# EasyEDA Pro project ProProject_Access Control Core_2024-06-07.epro, board V2.0.1 Core PCB
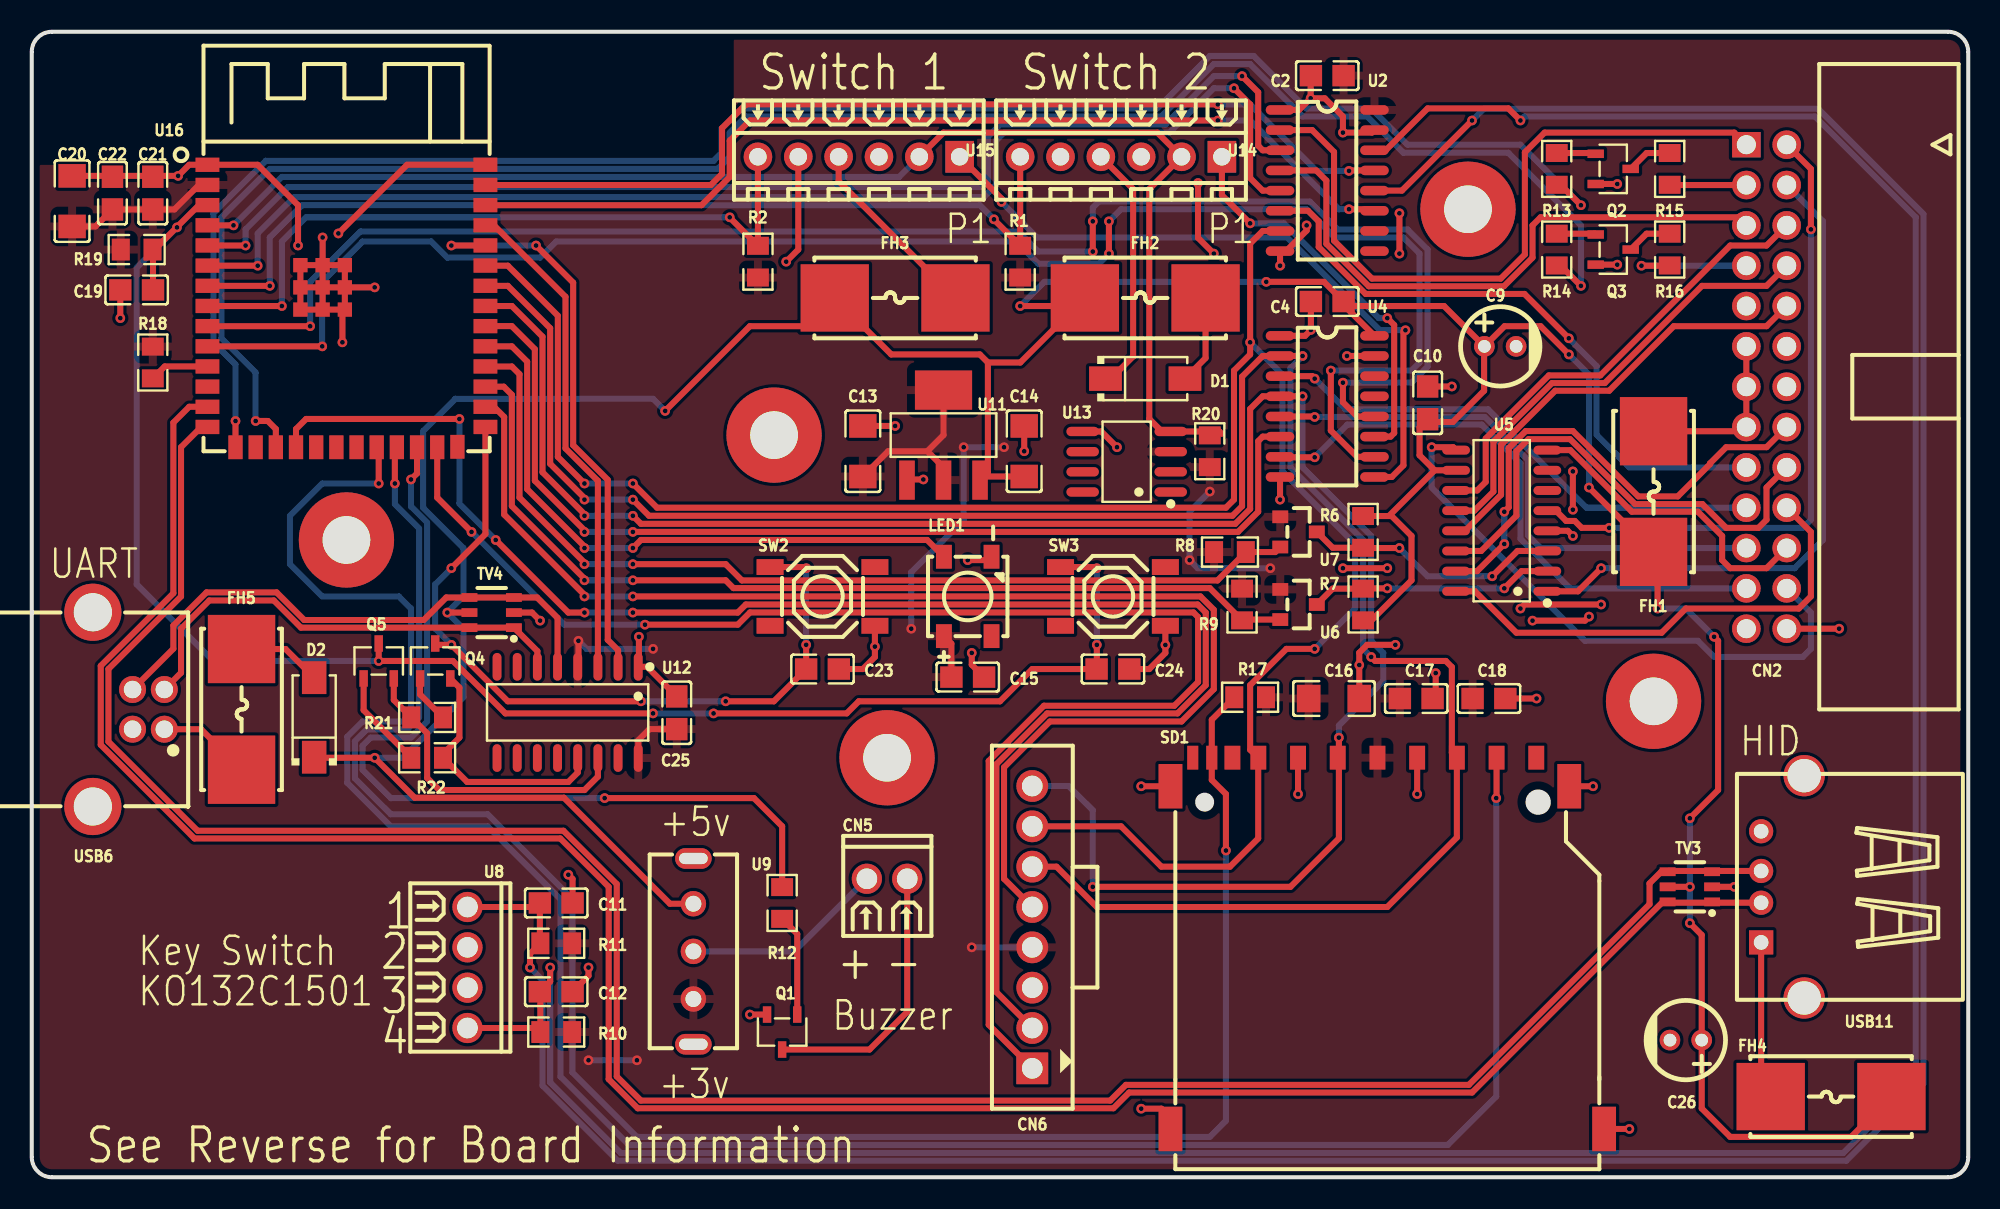
[diagram p13: board, top side]
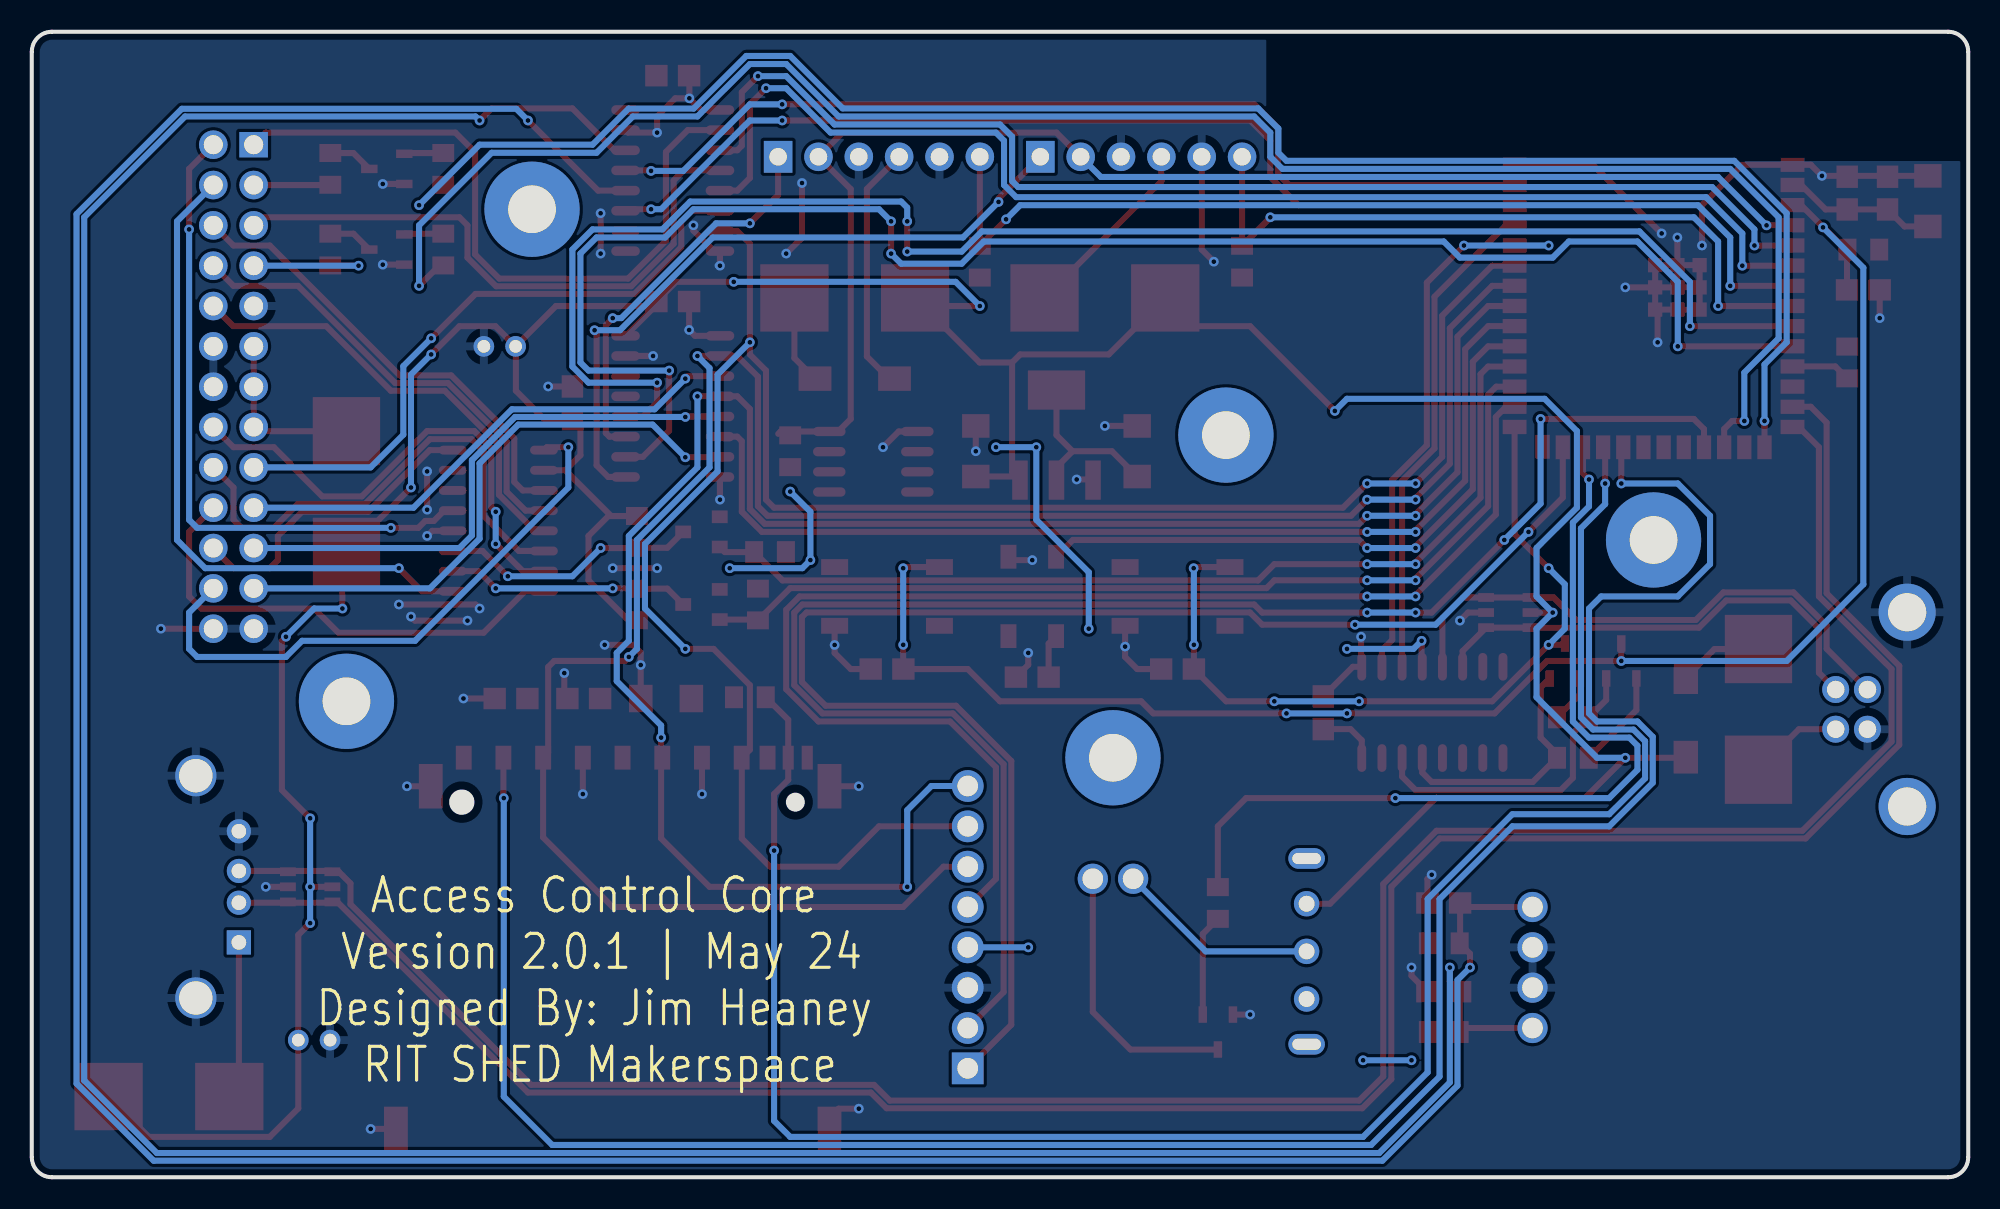
[diagram p14: board, bottom side, seen from below]

Outline 121.92 x 72.14 mm; copper layers: Top Layer, Bottom Layer. Coordinates in mm from the lower left corner of the outline.
Outline path: 0,70.87 0,1.27 arc(0.37,0.37) 1.27,0 120.65,0 arc(121.55,0.37) 121.92,1.27 121.92,70.87 arc(121.55,71.76) 120.65,72.14 1.27,72.14 arc(0.37,71.76) 0,70.87
Stack: Top Layer 0.035mm / Dielectric1 1.51mm FR4 er 4.5 / Bottom Layer 0.035mm

## Design rules (mm)
template: JLCPCB Capability(Two Layers Board)
spacing copperThickness1oz (default): track to track 0.102, other pairs 0.152 to 0.3
spacing copperThickness2oz: track to track 0.203, other pairs 0.152 to 0.3
track width copperThickness1oz (default): min 0.127, default 0.254, max 2.54
track width copperThickness2oz: min 0.203, default 0.254, max 2.54
differential pair differentialPair (default): width min 0.127, default 0.254, max 2.54; gap min 0.152, default 0.152
via viaSize (default): diameter min 0.5, default 0.61, max 10; hole min 0.3, default 0.305, max 6.3

## Placement (name value [footprint] x y rotation side)
C2  100nF  [C0805]  81.56 69.37 0 top
C4  100nF  [C0805]  81.56 55.15 0 top
C9  100uF  [CAP-TH_BD5.0-P2.00-D0.8-FD]  92.46 52.32 0 top
C10  100nF  [C0805]  87.88 48.77 270 top
C11  100nF  [C0805]  33.02 17.27 180 top
C12  100nF  [C0805]  33.02 11.68 0 top
C13  22uF  [C1206]  52.32 45.72 270 top
C14  22uF  [C1206]  62.48 45.72 270 top
C15  100nF  [C0805]  58.93 31.5 180 top
C16  22uF  [C1206]  81.99 30.15 180 top
C17  100nF  [C0805]  87.17 30.15 180 top
C18  100nF  [C0805]  91.75 30.15 180 top
C19  1uF  [C0805]  6.6 55.88 0 top
C20  22uF  [C1206]  2.54 61.47 270 top
C21  100nF  [C0805]  7.62 61.98 270 top
C22  1uF  [C0805]  5.08 61.98 270 top
C23  100nF  [C0805]  49.78 32 0 top
C24  100nF  [C0805]  68.07 32 0 top
C25  100nF  [C0805]  40.61 29.25 90 top
C26  100uF  [CAP-TH_BD5.0-P2.00-D0.8-FD]  104.14 8.64 180 top
CN2  2.54-2*13P弯简牛  [IDC-TH_26P-P2.54_BOOMELE-2X13P-2.54MM-H]  109.22 49.78 90 top
CN5  MX128-2.54-02P-GN01-Cu-Y-A  [CONN-TH_2P-P2.54_MX128-2.54-GN01-02P-CU-Y-A]  53.85 18.8 0 top
CN6  X9556WV-08-N0V01  [CONN-TH_8P-P2.54_X9556WV-08-N0V01]  62.99 15.75 90 top
D1  SS54  [SMA_L4.4-W2.8-LS5.4-R-RD]  70.1 50.29 0 top
D2  SS54  [SMA_L4.4-W2.8-LS5.4-R-RD]  17.78 28.96 90 top
FH1  01550900M  [FUSE-SMD_L9.8-W5.0]  102.11 43.18 90 top
FH2  01550900M  [FUSE-SMD_L9.8-W5.0]  70.1 55.37 180 top
FH3  01550900M  [FUSE-SMD_L9.8-W5.0]  54.36 55.37 180 top
FH4  01550900M  [FUSE-SMD_L9.8-W5.0]  113.28 5.08 0 top
FH5  01550900M  [FUSE-SMD_L9.8-W5.0]  13.21 29.46 90 top
LED1  XL-5050RGBC-WS2812B  [LED-SMD_4P-L5.0-W5.0-BL_XL-5050RGBC]  58.93 36.58 0 top
NOREF  -  [Pad_e102]  19.81 40.13 0 top
NOREF#2  -  [Pad_e104]  102.11 29.97 0 top
NOREF#3  -  [Pad_e100]  53.85 26.42 0 top
NOREF#4  -  [Pad_e103]  46.74 46.74 0 top
NOREF#5  -  [Pad_e112]  90.42 60.96 0 top
Q1  S8050 J3Y  [SOT-23-3_L3.0-W1.7-P0.95-LS2.9-BR]  47.24 9.14 90 top
Q2  S8050 J3Y  [SOT-23-3_L3.0-W1.7-P0.95-LS2.9-BR]  99.57 63.5 180 top
Q3  S8050 J3Y  [SOT-23-3_L3.0-W1.7-P0.95-LS2.9-BR]  99.57 58.42 180 top
Q4  S8050 J3Y  [SOT-23-3_L3.0-W1.7-P0.95-LS2.9-BR]  25.4 32.51 270 top
Q5  S8050 J3Y  [SOT-23-3_L3.0-W1.7-P0.95-LS2.9-BR]  21.84 32.51 270 top
R1  5.1kΩ  [R0805]  62.23 57.66 90 top
R2  5.1kΩ  [R0805]  45.72 57.66 90 top
R6  10kΩ  [R0805]  83.82 40.64 90 top
R7  10kΩ  [R0805]  83.82 36.07 270 top
R8  10kΩ  [R0805]  75.44 39.37 180 top
R9  10kΩ  [R0805]  76.2 36.07 90 top
R10  100kΩ  [R0805]  33.02 9.14 0 top
R11  100kΩ  [R0805]  33.02 14.73 180 top
R12  10kΩ  [R0805]  47.24 17.27 90 top
R13  10kΩ  [R0805]  96.01 63.5 270 top
R14  10kΩ  [R0805]  96.01 58.42 270 top
R15  1kΩ  [R0805]  103.12 63.5 270 top
R16  1kΩ  [R0805]  103.12 58.42 270 top
R17  10kΩ  [R0805]  76.71 30.23 180 top
R18  10kΩ  [R0805]  7.62 51.31 270 top
R19  10kΩ  [R0805]  6.6 58.42 0 top
R20  4.7kΩ  [R0805]  74.17 45.72 270 top
R21  10kΩ  [R0805]  24.89 28.96 180 top
R22  10kΩ  [R0805]  24.89 26.42 0 top
SD1  SD-112  [SD-SMD_SD-112]  85.34 14.73 0 top
SW2  TS-1187A-B-A-B  [SW-SMD_4P-L5.1-W5.1-P3.70-LS6.5-TL-2]  49.78 36.58 0 top
SW3  TS-1187A-B-A-B  [SW-SMD_4P-L5.1-W5.1-P3.70-LS6.5-TL-2]  68.07 36.58 0 top
TV3  SRV05-4-P-T7  [SOT-23-6_L2.9-W1.6-P0.95-LS2.8-BR]  104.39 18.29 0 top
TV4  SRV05-4-P-T7  [SOT-23-6_L2.9-W1.6-P0.95-LS2.8-BR]  28.96 35.56 0 top
U2  SN74HCS367DR  [SOIC-16_L9.9-W3.9-P1.27-LS6.0-BL-1]  81.56 62.77 270 top
U4  SN74HCS367DR  [SOIC-16_L9.9-W3.9-P1.27-LS6.0-BL-1]  81.56 48.54 270 top
U5  TM1650-SOP16-TA1809C  [SOP-16_L10.0-W3.9-P1.27-LS6.0-BL]  92.55 41.34 90 top
U6  BSS138LT1G-ES  [SOT-23_L2.9-W1.3-P1.90-LS2.4-BR]  79.76 36.07 180 top
U7  BSS138LT1G-ES  [SOT-23_L2.9-W1.3-P1.90-LS2.4-BR]  79.76 40.64 180 top
U8  MX128-2.54-04P-GN01-Cu-Y-A  [CONN-TH_4P-P2.54_MX128-2.54-GN01-04P-CU-Y-A]  27.43 13.21 270 top
U9  HX SS12F44G4  [SW-TH_SHOU-HAN_SS12F44G4]  41.66 14.22 90 top
U11  AMS1117-3.3  [SOT-223-4_L6.5-W3.5-P2.30-LS7.0-BR]  57.4 46.74 270 top
U12  CH340C  [SOP-16_L10.0-W3.9-P1.27-LS6.0-BL]  33.74 29.27 180 top
U13  DS18B20Z+T&R  [SOIC-8_L4.9-W3.9-P1.27-LS6.0-BL]  68.94 45.06 90 top
U14  MX128-2.54-06P-GN01-Cu-Y-A  [CONN-TH_6P-P2.54_MX128-2.54-6P]  68.58 64.26 180 top
U15  MX128-2.54-06P-GN01-Cu-Y-A  [CONN-TH_6P-P2.54_MX128-2.54-6P]  52.07 64.26 180 top
U16  2.4GHz  [WIRELM-SMD_ESP32-S3-WROOM-1]  19.81 54.86 0 top
USB6  BF 90°  [USB-B_TH_BF90]  6.1 29.46 270 top
USB11  903-131A1011D10100  [USB-A-TH_C46407]  110.24 18.29 90 top

## Footprints (pads in the part's own frame, mm; a bottom-side part is the same pattern mirrored in y, then rotated)
C0805
  rect 1.41x1.35 smd: 1(-1.03,0) 2(1.03,0)
C1206
  rect 1.485x1.728 smd: 1(-1.593,0) 2(1.593,0)
CAP-TH_BD5.0-P2.00-D0.8-FD
  round 1.3 hole 0.8: 1(-1,0) 2(1,0)
CONN-TH_2P-P2.54_MX128-2.54-GN01-02P-CU-Y-A
  round 1.9 hole 1.3: 1(-1.27,0) 2(1.27,0)
CONN-TH_4P-P2.54_MX128-2.54-GN01-04P-CU-Y-A
  round 1.9 hole 1.3: 1(-3.81,0) 2(-1.27,0) 3(1.27,0) 4(3.81,0)
CONN-TH_6P-P2.54_MX128-2.54-6P
  rect 1.8x2 hole 1.1: 1(-6.35,0)
  round 1.8 hole 1.1: 2(-3.81,0) 3(-1.27,0) 4(1.27,0) 5(3.81,0) 6(6.35,0)
CONN-TH_8P-P2.54_X9556WV-08-N0V01
  rect 2x2 hole 1.3: 1(-8.89,0)
  round 2 hole 1.3: 2(-6.35,0) 3(-3.81,0) 4(-1.27,0) 5(1.27,0) 6(3.81,0) 7(6.35,0) 8(8.89,0)
FUSE-SMD_L9.8-W5.0
  rect 4.3x4.24 smd: 1(-3.8,0) 2(3.8,0)
IDC-TH_26P-P2.54_BOOMELE-2X13P-2.54MM-H
  rect 1.6x1.8 hole 1.2: 1(15.24,1.27)
  round 1.8 hole 1.2: 2(15.24,-1.27) 3(12.7,1.27) 4(12.7,-1.27) 5(10.16,1.27) 6(10.16,-1.27) 7(7.62,1.27) 8(7.62,-1.27) 9(5.08,1.27) 10(5.08,-1.27) 11(2.54,1.27) 12(2.54,-1.27) 13(0,1.27) 14(0,-1.27) 15(-2.54,1.27) 16(-2.54,-1.27) 17(-5.08,1.27) 18(-5.08,-1.27) 19(-7.62,1.27) 20(-7.62,-1.27) 21(-10.16,1.27) 22(-10.16,-1.27) 23(-12.7,1.27) 24(-12.7,-1.27) 25(-15.24,1.27) 26(-15.24,-1.27)
LED-SMD_4P-L5.0-W5.0-BL_XL-5050RGBC
  rect 1x1.5 smd: 1(-1.5,-2.5) 2(1.5,-2.5) 3(1.5,2.5) 4(-1.5,2.5)
Pad_e100
  round 6 hole 3: 42(0,0)
Pad_e102
  round 6 hole 3: 42(0,0)
Pad_e103
  round 6 hole 3: 42(0,0)
Pad_e104
  round 6 hole 3: 42(0,0)
Pad_e112
  round 6 hole 3: 42(0,0)
R0805
  rect 1.133x1.377 smd: 1(-1,0) 2(1,0)
SD-SMD_SD-112
  rect 1x1.5 smd: 1(6.88,11.69) 2(4.38,11.69) 3(1.88,11.69) 4(-0.62,11.69) 5(-3.12,11.69) 6(-5.62,11.69) 7(-8.12,11.69) 8(-9.75,11.69) 9(9.38,11.69)
  rect 0.7x1.5 smd: 10(-11.05,11.69) 11(-12.25,11.69)
  rect 1.5x2.8 smd: 12(-13.65,9.89) 12(-13.65,-11.69) 12(11.455,9.89) 12(13.65,-11.69)
SMA_L4.4-W2.8-LS5.4-R-RD
  rect 2.062x1.539 smd: 1(2.503,0) 2(-2.503,0)
SOIC-8_L4.9-W3.9-P1.27-LS6.0-BL
  oval 0.588x2.045 smd: 1(-1.905,-2.772) 2(-0.635,-2.772) 3(0.635,-2.772) 4(1.905,-2.772) 5(1.905,2.772) 6(0.635,2.772) 7(-0.635,2.772) 8(-1.905,2.772)
SOIC-16_L9.9-W3.9-P1.27-LS6.0-BL-1
  oval 0.6x1.8 smd: 1(-4.445,-2.972) 2(-3.175,-2.972) 3(-1.905,-2.972) 4(-0.635,-2.972) 5(0.635,-2.972) 6(1.905,-2.972) 7(3.175,-2.972) 8(4.445,-2.972) 9(4.445,2.972) 10(3.175,2.972) 11(1.905,2.972) 12(0.635,2.972) 13(-0.635,2.972) 14(-1.905,2.972) 15(-3.175,2.972) 16(-4.445,2.972)
SOP-16_L10.0-W3.9-P1.27-LS6.0-BL
  oval 0.56x1.745 smd: 1(-4.445,-2.873) 2(-3.175,-2.873) 3(-1.905,-2.873) 4(-0.635,-2.873) 5(0.635,-2.873) 6(1.905,-2.873) 7(3.175,-2.873) 8(4.445,-2.873) 9(4.445,2.873) 10(3.175,2.873) 11(1.905,2.873) 12(0.635,2.873) 13(-0.635,2.873) 14(-1.905,2.873) 15(-3.175,2.873) 16(-4.445,2.873)
SOT-23-3_L3.0-W1.7-P0.95-LS2.9-BR
  rect 1.038x0.532 smd: 1(1.101,-0.95) 2(1.101,0.95) 3(-1.101,0)
SOT-23-6_L2.9-W1.6-P0.95-LS2.8-BR
  rect 1x0.55 smd: 1(1.4,-0.95) 2(1.4,0) 3(1.4,0.95) 4(-1.4,0.95) 5(-1.4,0) 6(-1.4,-0.95)
SOT-23_L2.9-W1.3-P1.90-LS2.4-BR
  rect 1x0.8 smd: 1(1.15,-0.95) 2(1.15,0.95) 3(-1.15,0)
SOT-223-4_L6.5-W3.5-P2.30-LS7.0-BR
  rect 2.47x0.98 smd: 1(2.835,-2.3) 2(2.835,0) 3(2.835,2.3)
  rect 2.47x3.6 smd: 4(-2.835,0)
SW-SMD_4P-L5.1-W5.1-P3.70-LS6.5-TL-2
  rect 1.7x1 smd: 1(-3.3,1.85) 2(3.3,1.85) 3(-3.3,-1.85) 4(3.3,-1.85)
SW-TH_SHOU-HAN_SS12F44G4
  round 1.6 hole 1: 1(-3,0) 2(0,0) 3(3,0)
  oval 1.3x2.3 hole 0.7x1.8: 4(5.85,0) 5(-5.85,0)
USB-A-TH_C46407
  rect 1.524x1.524 hole 0.92: 1(-3.5,1.355)
  round 1.524 hole 0.92: 2(-1,1.355) 3(1,1.355) 4(3.5,1.355)
  round 2.6 hole 2.1: 5(7,-1.355) 6(-7,-1.355)
USB-B_TH_BF90
  round 1.7 hole 1.1: 1(1.25,2.25) 2(-1.25,2.25) 3(-1.25,0.25) 4(1.25,0.25)
  round 3.6 hole 2.4: 5(-6.117,-2.25) 5(6.117,-2.25)
WIRELM-SMD_ESP32-S3-WROOM-1
  rect 1.5x0.9 smd: 1(-8.75,8.895) 2(-8.75,7.625) 3(-8.75,6.355) 4(-8.75,5.085) 5(-8.75,3.815) 6(-8.75,2.545) 7(-8.75,1.275) 8(-8.75,0.005) 9(-8.75,-1.265) 10(-8.75,-2.535) 11(-8.75,-3.805) 12(-8.75,-5.075) 13(-8.75,-6.345) 14(-8.75,-7.615) 27(8.75,-7.615) 28(8.75,-6.345) 29(8.75,-5.075) 30(8.75,-3.805) 31(8.75,-2.535) 32(8.75,-1.265) 33(8.75,0.005) 34(8.75,1.275) 35(8.75,2.545) 36(8.75,3.815) 37(8.75,5.085) 38(8.75,6.355) 39(8.75,7.625) 40(8.75,8.895)
  rect 0.9x1.5 smd: 15(-6.985,-8.895) 16(-5.715,-8.895) 17(-4.445,-8.895) 18(-3.175,-8.895) 19(-1.905,-8.895) 20(-0.635,-8.895) 21(0.635,-8.895) 22(1.905,-8.895) 23(3.175,-8.895) 24(4.445,-8.895) 25(5.715,-8.895) 26(6.985,-8.865)
  rect 0.9x0.9 smd: 41(-2.9,2.575) 41(-2.9,1.175) 41(-2.9,-0.225) 41(-1.5,2.575) 41(-1.5,1.175) 41(-1.5,-0.225) 41(-0.1,2.575) 41(-0.1,1.175) 41(-0.1,-0.225)

## Nets
As in the schematic, except:
KEY2_BOUNCE: C12.1 R10.1 U2.14 U8.4

Pads without a net: LED1 2; NOREF 42; NOREF#2 42; NOREF#3 42; NOREF#4 42; NOREF#5 42; SD1 8 9 11; SW2 2 3; SW3 2 3; U2 9 10; U4 13 14; U5 6 7; U9 4 5; U12 7 8 9 10 11 12 15; U13 1 2 6 7 8; U16 12 16 19 20 21 26

## Via types
v1: diameter 0.61, hole 0.305, Top Layer to Bottom Layer, 176 vias

## Routing (per net, layer and track width the routed paths; a pad name or vN(x,y) marks a point on that pad's centre or on a via; arc(x,y) is an arc through that point)
+5V: length 254.9
  Top Layer w0.381: TV3.5 v1(104.39,18.29) ; U9.3 40.18,17.22 33.5,23.9 24.1,23.9 v1(21.59,26.42) 18.03,26.42 17.78,26.16 D2.2 ; 87.71,47.56 87.38,47.23 87.38,45.47 88.32,44.52 ; 87.71,47.56 C10.2 ; 87.71,47.56 89.47,47.56 91.44,49.53 91.44,52.31 C9.1 ; 85.44,41.64 88.32,44.52 ; 85.44,41.64 R6.2 ; 85.44,41.64 85.61,41.64 86.87,40.39 86.87,37.59 84.34,35.07 R7.2 ; 88.32,44.52 U5.10 ; 60.2,51.31 60.2,44.4 59.93,44.13 ; 60.2,51.31 59.69,51.82 54.11,51.82 FH3.2 48.78,53.59 45.21,53.59 v1(39.88,48.26) ; 60.2,51.31 62.24,51.31 65.8,54.86 ; v1(102.36,35.81) 102.36,39.13 FH1.1 102.1,39.38 v1(98.04,43.43) ; C9.1 92.73,53.59 95,53.59 v1(96.77,51.82) ; C9.1 88.92,54.86 82.88,54.86 C4.2 ; U4.16 82.59,54.93 C4.2 ; C4.2 81.35,56.39 v1(77.72,56.39) ; 59.93,44.13 U11.3 ; 59.93,44.13 C14.2 ; FH4.2 114.54,2.54 106.93,2.54 105.14,4.33 C26.1 105.14,15.26 v1(104.39,16) ; v1(62.23,54.86) 65.8,54.86 ; 65.8,54.86 FH2.2 ; v1(105.92,34.04) 106.17,33.78 106.17,24.38 v1(104.39,22.61) ; v1(26.16,35.56) TV4.5
  Bottom Layer w0.381: v1(104.39,16) v1(104.39,18.29) v1(104.39,22.61) ; v1(105.92,34.04) 104.14,35.81 v1(102.36,35.81) ; v1(62.23,54.86) 63.75,56.39 v1(77.72,56.39) ; v1(98.04,43.43) 98.04,50.55 v1(96.77,51.82) ; v1(21.59,26.42) 23.37,26.42 27.18,30.23 27.18,34.54 v1(26.16,35.56) 27.18,36.58 27.18,39.62 24.64,42.16 24.64,46.99 26.67,49.02 39.12,49.02 v1(39.88,48.26)
GND: length 165.3
  Top Layer w0.381: U4.1 80.17,52.99 v1(80.53,53.36) C4.1 ; U13.5 67.34,46.96 v1(68.33,45.97) ; SD1.3 v1(87.22,24.13) ; C11.1 34.05,18.78 v1(33.78,19.05) ; 7.57,63.06 v1(9.21,63.06) 9.91,63.76 14.22,63.76 16.76,61.21 v1(16.76,58.67) ; 7.57,63.06 C20.1 ; 7.57,63.06 C21.1 ; C18.1 v1(94.74,30.15) ; v1(38.23,34.04) 38.23,32.19 U12.1 38.74,32.14 C25.2 ; TV4.2 31.5,35.56 v1(32,35.05) ; Q3.2 v1(99.82,57.47) ; v1(107.19,18.29) TV3.2 ; v1(59.18,33.02) 59.18,32.27 C15.1 ; v1(97.03,40.39) 96.7,40.71 U5.4 ; C24.2 70.36,32 71.37,33.02 v1(71.37,33.52) SW3.4 ; LED1.3 60.21,38.86 v1(58.93,38.86) ; Q1.2 v1(45.21,10.25) ; C17.1 88.39,30.34 v1(88.39,31.75) ; v1(56.13,43.94) 55.15,43.94 U11.1 ; C13.1 v1(54.36,47.31) ; v1(93.73,35.81) 93.98,36.07 v1(98.81,36.07) ; CN2.26 v1(113.79,34.54) ; v1(19.56,52.58) 19.56,54.49 U16.41 ; v1(80.52,67.95) 81.41,67.95 82.55,66.8 v1(82.55,65.79) 84.38,65.79 U2.15 ; v1(80.52,67.95) 80.52,69.36 C2.1 ; v1(80.52,67.95) 79.79,67.21 U2.1 ; 28.56,63.76 23.63,63.76 v1(19.3,59.44) ; SW2.4 v1(53.08,33.42) 53.08,32.76 52.32,32 C23.2 ; U4.15 v1(82.8,51.72) ; v1(85.85,33.53) 84.07,33.53 83.58,33.03 v1(83.58,32.26) C16.1 ; U15.5 48.26,58.42 v1(47.5,57.66) ; C14.1 v1(62.48,45.72) ; v1(97.03,44.45) v1(97.03,42.04) ; v1(82.55,38.35) v1(85.34,38.35) ; v1(74.42,58.17) 73.43,59.16 v1(73.43,62.61) ; SD1.12 v1(98.3,24.62) ; 16.91,56.04 U16.41 U16.41 ; 16.91,56.04 U16.41 U16.41 ; 16.91,56.04 18.31,56.04 ; U16.41 U16.41 ; U16.41 19.71,56.04 ; U16.41 18.31,56.04 ; SD1.12 71.69,3.74 71.12,4.32 v1(69.85,4.32) ; 18.31,56.04 19.71,56.04 ; 18.31,56.04 U16.41 ; U16.41 U16.41 19.71,56.04 ; U16.41 v1(18.31,59.18) ; U4.8 v1(78.59,42.67) ; v1(86.11,58.17) v1(86.11,60.71) ; SD1.12 v1(69.85,24.62) ; SD1.6 v1(79.72,24.13) ; v1(80.26,59.94) 80.26,59.61 78.97,58.32 U2.8 v1(78.59,57.4) ; v1(98.04,35.31) 97.79,35.05 v1(94.49,35.05) ; C19.1 v1(5.57,54.1) ; 19.71,56.04 v1(21.59,56.04) ; C12.2 35.05,12.69 v1(35.05,13.21) ; C10.1 v1(89.41,49.8) ; SD1.12 v1(100.58,3.04) ; Q2.2 v1(99.82,62.55)
  Bottom Layer w0.381: v1(98.3,24.62) 98.3,24.64 ; v1(78.59,57.4) 78.74,57.4 ; v1(18.31,59.18) 18.29,59.18
VCC: length 66.3
  Top Layer w0.381: 56.39,45.72 57.4,46.74 57.4,49.57 ; 56.39,45.72 53.92,45.72 C13.2 ; 56.39,45.72 57.4,44.7 U11.2 ; U12.4 34.42,32.19 v1(34.42,33.78) ; C20.2 4.01,59.88 C22.2 C21.2 8.98,60.95 10.52,62.49 U16.2 ; U12.16 38.18,27.52 38.89,28.22 C25.1 ; C15.2 57.9,33.61 LED1.1
  Bottom Layer w0.381: v1(59.18,14.48) CN6.4 ; v1(74.17,43.18) 72.9,41.91 v1(72.9,38.86) 73.41,38.35 v1(77.98,38.35) ; v1(34.42,33.78) 34.92,33.27 v1(39.12,33.27) ; v1(55.37,34.54) 55.37,38.1 58.67,41.4 v1(58.67,45.97) v1(61.21,45.97) ; v1(38.1,7.37) v1(35.05,7.37)
B1_LK: length 4.8
  Top Layer w0.381: CN2.3 103.14,62.48 R15.2
B1_SW: length 44.4
  Top Layer w0.381: CN2.1 107.19,65.79 95.25,65.79 94.01,64.54 94.01,58.11 92.48,56.59 84.38,56.59 81.99,58.98 81.99,64.57 80.62,65.94 U2.2
B1LED: length 112.4
  Top Layer w0.381: v1(97.54,61.21) 96.25,62.5 R13.2 ; v1(12.83,47.63) U16.15
  Bottom Layer w0.381: v1(12.83,47.63) 12.83,51.18 11.43,52.58 11.43,60.71 14.73,64.01 42.93,64.01 43.43,64.52 43.43,66.04 44.7,67.31 70.87,67.31 74.17,70.61 76.93,70.61 80.25,67.3 84.34,67.3 86.61,65.02 93.73,65.02 v1(97.54,61.21)
B2_LK: length 7.9
  Top Layer w0.381: v1(101.35,57.4) 102.62,57.4
  Bottom Layer w0.381: v1(101.35,57.4) CN2.7
B2_SW: length 37.9
  Top Layer w0.381: U2.4 80.87,63.4 81.51,62.76 81.51,58.78 84.18,56.11 92.68,56.11 94.49,57.91 94.49,59.94 95,60.45 107.44,60.45 CN2.5
B2LED: length 116.9
  Top Layer w0.381: v1(97.54,56.13) 96.25,57.42 R14.2 ; 15.37,45.97 15.37,47.12 14.86,47.63 v1(14.1,47.63)
  Bottom Layer w0.381: v1(14.1,47.63) 14.1,50.67 11.94,52.83 11.94,60.45 14.99,63.5 43.18,63.5 43.94,64.26 43.94,65.79 44.96,66.8 71.12,66.8 74.42,70.1 76.71,70.1 80.01,66.8 84.07,66.8 86.36,64.52 92.96,64.52 97.54,59.94 v1(97.54,56.13)
BUTTON1: length 78.1
  Top Layer w0.381: v1(13.46,58.67) 11.07,58.67 11.06,58.68 ; U2.3 77.5,64.67 77.22,64.96 77.22,68.33 v1(76.2,69.34)
  Bottom Layer w0.381: v1(76.2,69.34) 74.42,69.34 71.37,66.29 60.96,66.29 60.2,65.53 60.2,62.74 59.82,62.36 16.13,62.36 13.46,59.69 v1(13.46,58.67)
BUTTON2: length 80.4
  Top Layer w0.381: U16.6 11.07,57.4 v1(14.22,57.4) ; U2.5 77.5,62.13 76.71,62.93 76.71,67.56 v1(75.69,68.58)
  Bottom Layer w0.381: v1(14.22,57.4) 14.22,59.44 16.51,61.72 59.94,61.72 60.71,62.48 60.71,65.28 61.21,65.79 71.63,65.79 74.42,68.58 v1(75.69,68.58)
BUZZER: length 55.8
  Top Layer w0.381: R12.2 47.24,22.1 45.47,23.88 v1(36.07,23.88) ; v1(23.88,43.94) 24.26,44.32 U16.24
  Bottom Layer w0.381: v1(36.07,23.88) 22.61,23.88 20.83,25.65 20.83,27.18 21.34,27.69 23.88,27.69 24.89,28.7 24.89,41.23 23.88,42.24 v1(23.88,43.94)
CLK: length 60.3
  Top Layer w0.381: v1(37.85,37.59) 43.69,37.59 44.18,37.1 74.17,37.1 R9.1 76.25,35.12 U6.2 ; v1(34.8,37.59) 34.8,37.69 30.23,42.26 30.23,49.28 29.72,49.78 28.57,49.78 U16.29
  Bottom Layer w0.381: v1(37.85,37.59) v1(34.8,37.59)
CLK_HV: length 15.4
  Top Layer w0.381: v1(92.71,37.08) 93.79,38.17 U5.2 ; U6.3 81.91,37.07 R7.1 83.84,37.08 v1(85.34,37.08)
  Bottom Layer w0.381: v1(92.71,37.08) v1(85.34,37.08)
CS: length 65.4
  Top Layer w0.381: v1(34.8,40.64) 34.8,40.74 31.67,43.86 31.67,52.15 30.22,53.6 U16.32 ; U4.6 77.5,46.64 77.22,46.35 77.22,41.91 75.95,40.64 v1(37.85,40.64)
  Bottom Layer w0.381: v1(37.85,40.64) v1(34.8,40.64)
CS_HV: length 37.3
  Top Layer w0.381: v1(80.77,45.34) 78.62,45.34 U4.7
  Bottom Layer w0.381: v1(80.77,45.34) 82.83,47.4 91.29,47.4 93.73,44.96 93.73,40.21 96.85,37.08 CN2.23
CS_SD: length 145.7
  Top Layer w0.381: v1(21.84,43.69) 21.84,45.84 U16.22 ; v1(92.2,23.88) 92.22,23.9 SD1.1
  Bottom Layer w0.381: v1(92.2,23.88) 92.2,5.08 89.15,2.03 37.59,2.03 33.29,6.34 33.29,17.51 28.7,22.1 22.61,22.1 19.86,24.84 19.86,27.74 20.83,28.7 23.37,28.7 23.88,29.21 23.88,35.81 23.11,36.58 18.29,36.58 16.26,38.61 16.26,41.66 18.29,43.69 v1(21.84,43.69)
DIG1: length 42
  Top Layer w0.381: v1(98.81,38.35) 97.35,36.9 95.42,36.9
  Bottom Layer w0.381: v1(98.81,38.35) 111,38.35 112.78,40.13 112.78,60.2 CN2.4
DIG2: length 41.5
  Top Layer w0.381: v1(112.01,59.69) 112.01,63.5 CN2.2 ; v1(99.31,40.89) 97.58,40.89 97.15,41.33 96.61,41.33 95.96,41.98 U5.5
  Bottom Layer w0.381: v1(112.01,59.69) 112.01,41.4 111.51,40.89 v1(99.31,40.89)
DIO: length 61.1
  Top Layer w0.381: U7.2 78.29,39.37 R8.1 74.65,37.58 44.71,37.58 43.69,38.61 v1(37.85,38.61) ; 28.56,51.06 28.57,51.05 30.23,51.05 30.71,50.57 30.71,42.8 34.8,38.71 v1(34.8,38.61)
  Bottom Layer w0.381: v1(37.85,38.61) v1(34.8,38.61)
DIO_HV: length 16.3
  Top Layer w0.381: v1(91.95,37.85) 93.54,39.44 U5.3 ; v1(86.11,39.62) 83.84,39.62 R6.1 81.91,39.64 U7.3
  Bottom Layer w0.381: v1(91.95,37.85) 87.88,37.85 v1(86.11,39.62)
DM: length 151.3
  Top Layer w0.381: USB11.2 103.04,17.29 TV3.6 102.68,17.34 90.68,5.33 69.09,5.33 68.1,4.34 38.15,4.34 36.32,6.18 36.32,18.29 33.27,21.34 10.24,21.34 4.34,27.23 4.34,32.2 8.92,36.78 8.92,47.52 9.91,48.52 U16.13
DM_UART: length 29.7
  Top Layer w0.381: USB6.2 9.4,31.77 9.4,34.54 11.18,36.32 15.24,36.32 16.95,34.61 TV4.6 TV4.1 31.83,33.13 U12.6
DP: length 150
  Top Layer w0.381: U16.14 10.67,47.25 9.4,45.97 9.4,36.58 4.83,32 4.83,27.43 10.44,21.82 33.47,21.82 36.83,18.46 36.83,6.35 38.35,4.83 67.9,4.83 68.89,5.82 90.48,5.82 101.85,17.19 101.85,18.5 102.59,19.24 TV3.4 103.04,19.29 105.84,19.29 ; USB11.3 105.84,19.29 ; 105.84,19.29 TV3.3
DP_UART: length 35.1
  Top Layer w0.381: USB6.3 8.92,33.28 8.92,34.74 11,36.83 15.41,36.83 17.15,35.09 24.68,35.09 26.1,36.51 TV4.4 TV4.3 31.82,36.51 33.1,35.22 U12.5
DTR: length 15.9
  Top Layer w0.381: U12.13 34.37,25.48 33.78,24.89 27.42,24.89 R22.2 25.89,26.65 26.92,27.69 26.92,30.84 Q4.2
EN: length 105.5
  Top Layer w0.381: v1(67.06,38.35) 66.98,38.43 SW3.1 ; v1(67.06,33.53) 67.06,32.02 C24.1 62.99,32 60.96,29.97 52.07,29.97 51.31,29.21 v1(42.93,29.21) ; C19.2 7.63,58.39 R19.2 7.72,58.42 9.12,59.82 ; 9.12,59.82 10.52,61.22 U16.3 ; 9.12,59.82 v1(9.14,59.82) ; v1(39.12,29.21) 29.82,29.21 26.52,32.51 v1(21.84,32.51) Q5.3
  Bottom Layer w0.381: v1(67.06,38.35) v1(67.06,33.53) ; v1(21.84,32.51) 11.43,32.51 6.6,37.34 6.6,57.28 v1(9.14,59.82) ; v1(42.93,29.21) v1(39.12,29.21)
GPIO0: length 49.8
  Top Layer w0.381: v1(38.35,29.97) 29.97,29.97 v1(26.42,33.53) 25.49,33.53 Q4.3 ; v1(26.42,38.35) 28.56,40.5 U16.27 ; v1(43.69,29.97) 46.72,29.97 C23.1 v1(48.75,33.53) ; v1(48.77,38.35) 48.7,38.43 SW2.1
  Bottom Layer w0.381: v1(26.42,33.53) 25.4,34.54 25.4,37.34 v1(26.42,38.35) ; v1(43.69,29.97) v1(38.35,29.97) ; v1(48.77,38.35) 48.75,38.34 v1(48.75,33.53)
IO18: length 3.8
  Top Layer w0.381: R18.2 8.37,51.06 11.06,51.06
IRQ_NFC: length 104.7
  Top Layer w0.381: CN6.2 60.73,11.66 60.73,26.01 63.93,29.21 72.14,29.21 73.91,30.99 73.91,35.56 73.41,36.07 44.96,36.07 44.45,35.56 v1(37.85,35.56) ; v1(34.8,35.56) 33.78,35.56 v1(29.21,40.13) ; U16.18 16.64,47.12 17.27,47.75 v1(26.92,47.75)
  Bottom Layer w0.381: v1(29.21,40.13) 26.92,42.42 v1(26.92,47.75) ; v1(37.85,35.56) v1(34.8,35.56)
KEY1: length 61.9
  Top Layer w0.381: v1(82.93,60.96) 84.44,60.96 U2.11 ; U16.38 28.57,61.21 42.16,61.21 43.94,62.99 43.94,65.28 45.21,66.55 v1(74.68,66.55)
  Bottom Layer w0.381: v1(82.93,60.96) 82.3,60.96 76.71,66.55 v1(74.68,66.55)
KEY1_BOUNCE: length 201.9
  Top Layer w0.381: U8.1 31.74,17.02 C11.2 31.99,14.76 R11.2 31.37,14.08 v1(31.37,13.21) ; v1(90.68,66.55) 86.26,62.13 U2.12
  Bottom Layer w0.381: v1(90.68,66.55) 91.41,67.29 112.47,67.29 119.1,60.65 119.1,5.9 114.25,1.04 36.88,1.04 32.16,5.77 32.16,12.42 v1(31.37,13.21)
KEY2: length 61.5
  Top Layer w0.381: v1(82.93,63.37) 82.96,63.4 U2.13 ; U16.39 28.57,62.48 42.75,62.48 43.46,63.19 43.46,66.07 44.96,67.56 v1(74.68,67.56)
  Bottom Layer w0.381: v1(82.93,63.37) 80.9,63.37 76.71,67.56 v1(74.68,67.56)
KEY2_BOUNCE: length 198.6
  Top Layer w0.381: v1(32.64,13.21) 32.64,12.33 C12.1 32.02,11.65 R10.1 31.77,9.4 U8.4 ; U2.14 85.25,64.67 87.88,67.31 92.96,67.31 v1(93.73,66.55)
  Bottom Layer w0.381: v1(93.73,66.55) 93.98,66.8 112.27,66.8 118.62,60.45 118.62,6.1 114.05,1.52 37.08,1.52 32.64,5.97 v1(32.64,13.21)
LED: length 39.5
  Top Layer w0.381: v1(34.8,39.62) 34.8,39.72 31.19,43.33 31.19,51.36 30.23,52.32 28.57,52.32 U16.31 ; v1(37.85,39.62) 38.35,40.13 56.37,40.13 LED1.4
  Bottom Layer w0.381: v1(37.85,39.62) v1(34.8,39.62)
MISO: length 131.6
  Top Layer w0.381: 77.22,26.41 77.22,21.34 75.44,19.56 71.12,19.56 68.58,22.1 CN6.7 ; 77.22,26.41 SD1.7 ; 77.22,26.41 76.71,26.92 76.71,30.99 78.99,33.27 v1(80.77,33.27) ; U2.7 77.5,59.59 76.71,58.8 v1(76.71,52.58) 76.71,51.82 75.69,50.8 75.69,42.67 75.18,42.16 39.37,42.16 v1(37.85,43.69) ; v1(34.8,43.69) 33.12,45.36 33.12,54.25 29.97,57.4 28.57,57.4 U16.35
  Bottom Layer w0.381: v1(80.77,33.27) 83.31,35.81 83.31,39.88 78.74,44.45 78.74,50.55 v1(76.71,52.58) ; v1(37.85,43.69) v1(34.8,43.69)
MISO_HV: length 39.5
  Top Layer w0.381: U2.6 80.36,60.86 81.03,60.2 81.03,58.58 83.98,55.63 93.98,55.63 v1(96.77,52.83)
  Bottom Layer w0.381: v1(96.77,52.83) 98.53,51.08 98.53,46.76 100.58,44.7 CN2.17
MOSI: length 138.6
  Top Layer w0.381: v1(34.8,42.67) 34.8,42.77 32.64,44.93 32.64,53.47 29.97,56.13 28.57,56.13 U16.34 ; v1(37.85,42.67) 38.86,41.66 75.6,41.66 76.2,42.26 76.2,50.42 77.5,51.72 U4.2 v1(80.01,51.72) ; v1(84.33,32.77) 84.58,32.51 89.03,32.51 89.41,32.13 89.41,26.74 SD1.2 89.72,21.4 85.34,17.02 67.06,17.02 64.52,19.56 CN6.6
  Bottom Layer w0.381: v1(37.85,42.67) v1(34.8,42.67) ; v1(80.01,51.72) 79.25,50.96 79.25,44.7 83.82,40.13 83.82,33.27 v1(84.33,32.77)
MOSI_HV: length 32.8
  Top Layer w0.381: U4.3 80.62,50.45 v1(80.77,50.29)
  Bottom Layer w0.381: v1(80.77,50.29) 82.7,48.36 91.69,48.36 97.89,42.16 CN2.19
NO1: length 106.5
  Top Layer w0.381: v1(18.29,52.32) 11.07,52.32 U16.10 ; v1(81.79,50.8) 81.79,47.03 83.44,45.37 U4.10 ; v1(67.82,60.2) v1(67.82,58.17)
  Bottom Layer w0.381: v1(18.29,52.32) 18.29,56.39 20.83,58.93 25.15,58.93 26.16,57.91 32,57.91 33.02,58.93 61.98,58.93 63.37,57.53 67.18,57.53 v1(67.82,58.17) ; v1(81.79,50.8) 86.87,50.8 87.38,51.31 87.38,58.17 86.36,59.18 82.04,59.18 80.26,60.96 68.58,60.96 v1(67.82,60.2)
NO1_HV: length 43.6
  Top Layer w0.381: v1(61.05,61.42) 61.05,61.63 U15.1 ; U4.9 85.63,44.1 86.36,44.83 86.36,53.21 v1(86.49,53.34)
  Bottom Layer w0.381: 58.42,64.05 U15.1 ; v1(86.49,53.34) 84.88,53.34 79.04,59.18 63.29,59.18 v1(61.05,61.42)
NO2: length 102.3
  Top Layer w0.381: v1(17.53,53.59) 11.07,53.59 U16.9 ; U4.12 83.44,47.91 82.55,48.8 v1(82.55,50.04) ; v1(66.8,58.29) v1(66.8,60.2)
  Bottom Layer w0.381: v1(17.53,53.59) 17.53,56.39 20.7,59.56 62.1,59.56 63.37,58.29 v1(66.8,58.29) ; v1(82.55,50.04) 86.87,50.04 87.88,51.05 87.88,58.42 86.61,59.69 82.22,59.69 80.46,61.44 67.18,61.44 66.8,61.06 v1(66.8,60.2)
NO2_HV: length 24.8
  Top Layer w0.381: U4.11 85.55,46.64 85.78,46.86 85.78,53.67 v1(85.34,54.1) ; U14.1 74.93,61.85 v1(76.71,60.07)
  Bottom Layer w0.381: v1(76.71,60.07) 78.84,60.07 84.81,54.1 v1(85.34,54.1)
RST_NFC: length 94.7
  Top Layer w0.381: v1(27.69,40.64) 25.53,42.8 U16.25 ; CN6.1 60.25,9.6 60.25,26.21 63.73,29.69 71.94,29.69 73.43,31.19 73.43,35.28 73.14,35.57 45.22,35.57 44.45,34.8 v1(38.61,34.8)
  Bottom Layer w0.381: v1(27.69,40.64) 33.53,34.8 v1(38.61,34.8)
RTS: length 19.7
  Top Layer w0.381: U12.14 35.64,25.23 34.8,24.38 25.65,24.38 24.89,25.15 24.89,27.96 R21.2 22.79,30.05 Q5.2
RX: length 36.2
  Top Layer w0.381: U12.2 36.91,33.19 36.26,33.84 36.26,43.92 34.09,46.1 34.09,56.34 v1(31.75,58.67) ; v1(26.42,58.67) 28.56,58.67 28.56,58.68
  Bottom Layer w0.381: v1(31.75,58.67) v1(26.42,58.67)
SCK: length 126.4
  Top Layer w0.381: v1(37.85,41.66) 38.35,41.15 75.77,41.15 76.71,42.08 76.71,48.39 77.5,49.18 U4.4 v1(80.01,49.18) ; v1(66.8,18.29) 79.25,18.29 82.3,21.34 82.3,26.35 SD1.5 82.3,26.49 v1(82.3,27.69) ; v1(34.8,41.66) 34.8,41.76 32.16,44.4 32.16,52.93 30.23,54.86 28.57,54.86 U16.33
  Bottom Layer w0.381: v1(37.85,41.66) v1(34.8,41.66) ; v1(66.8,18.29) 66.8,23.11 65.28,24.64 CN6.8 ; v1(82.3,27.69) 82.3,28.45 85.09,31.24 85.09,33.02 84.33,33.78 84.33,40.39 80.01,44.7 v1(80.01,49.18)
SCK_HV: length 35.6
  Top Layer w0.381: U4.5 80.74,47.91 v1(80.77,47.88)
  Bottom Layer w0.381: v1(80.77,47.88) 91.49,47.88 94.21,45.16 94.21,40.41 95,39.62 CN2.21
SD_DETECT: length 123.3
  Top Layer w0.381: R17.2 74.29,28.81 SD1.10 74.29,25.02 75.18,24.13 v1(75.18,20.57) ; v1(22.86,43.69) 22.86,45.84 U16.23
  Bottom Layer w0.381: v1(75.18,20.57) 75.18,3.56 74.17,2.54 38.1,2.54 34.04,6.6 34.04,17.53 28.7,22.86 22.61,22.86 20.35,25.12 20.35,27.46 21.08,28.19 23.62,28.19 24.38,28.96 24.38,40.86 22.86,42.39 v1(22.86,43.69)
SEG_DP: length 30.6
  Top Layer w0.381: CN2.20 112.01,40.64 112.01,36.58 111.25,35.81 104.14,35.81 102.62,34.29 93.47,34.29 90.86,36.9 89.67,36.9
SEGA: length 19.6
  Top Layer w0.381: U5.8 96.86,45.79 100.74,41.91 104.9,41.91 106.43,40.39 106.43,38.86 106.93,38.35 109.22,38.35 CN2.22
SEGB: length 37.1
  Top Layer w0.381: U5.9 89.49,45.97 v1(88.14,45.97)
  Bottom Layer w0.381: v1(88.14,45.97) 88.14,43.43 97.79,33.78 104.9,33.78 105.92,32.77 111.51,32.77 112.01,33.27 112.01,35.56 CN2.24
SEGC: length 29.3
  Top Layer w0.381: U5.11 91,43.25 91.54,43.79 91.54,46.52 95.52,50.5 98.76,50.5 106.93,58.67 109.22,58.67 CN2.6
SEGD: length 29
  Top Layer w0.381: U5.12 90.83,41.98 92.02,43.18 92.02,46.32 95.72,50.01 99.03,50.01 105.16,56.13 109.22,56.13 CN2.8
SEGE: length 28.5
  Top Layer w0.381: U5.13 90.24,40.71 92.51,42.98 92.51,46.12 95.92,49.53 99.31,49.53 103.38,53.59 109.22,53.59 CN2.10
SEGF: length 31.2
  Top Layer w0.381: U5.14 91.25,39.44 93.47,41.66 93.47,45.72 94.23,46.48 96.85,46.48 100.94,42.39 105.18,42.39 106.68,40.89 108.71,40.89 109.22,41.4 109.22,43.43 CN2.18
SEGG: length 31.4
  Top Layer w0.381: v1(92.71,41.91) 92.99,42.19 92.99,45.92 94.06,46.99 97.03,46.99 101.14,42.88 103.63,42.88 105.66,44.91 105.66,44.96 106.68,45.97 109.22,45.97 CN2.16 ; U5.15 91,38.17 v1(92.71,39.88)
  Bottom Layer w0.381: v1(92.71,41.91) v1(92.71,39.88)
SS_NFC: length 84.1
  Top Layer w0.381: U16.28 29.1,48.52 29.74,47.88 29.74,41.73 34.8,36.68 v1(34.8,36.58) ; 62.65,17.36 61.21,18.8 61.21,25.81 64.1,28.7 72.39,28.7 74.42,30.73 74.42,35.73 73.58,36.58 v1(37.85,36.58)
  Bottom Layer w0.381: v1(37.85,36.58) v1(34.8,36.58)
SW_TYPE1: length 45.7
  Top Layer w0.381: U15.6 R2.2 43.94,60.44 v1(43.94,60.45) ; v1(15.75,54.86) 11.07,54.86 U16.8
  Bottom Layer w0.381: v1(43.94,60.45) 17.27,60.45 15.75,58.93 v1(15.75,54.86)
SW_TYPE2: length 61.7
  Top Layer w0.381: v1(14.99,56.13) 11.07,56.13 U16.7 ; U14.6 R1.2 60.58,60.31 v1(60.58,60.33)
  Bottom Layer w0.381: v1(60.58,60.33) 59.69,61.21 17.02,61.21 14.99,59.18 v1(14.99,56.13)
TEMP: length 86.7
  Top Layer w0.381: U15.2 57.4,65.79 70.87,65.79 U14.2 70.36,62.23 70.36,47.75 71.15,46.96 U13.4 74.77,46.96 74.92,46.82 ; v1(12.7,59.94) 11.07,59.94 U16.4
  Bottom Layer w0.381: v1(12.7,59.94) 15.75,62.99 54.61,62.99 U15.2
TX: length 31.1
  Top Layer w0.381: U12.3 35.64,43.86 33.6,45.9 33.6,55.45 29.11,59.94 28.57,59.94 U16.37
$1N1268: length 2.5
  Top Layer w0.381: R13.1 98.42,64.5 Q2.1
$1N1379: length 2.5
  Top Layer w0.381: R14.1 98.42,59.42 Q3.1
$1N1451: length 2.9
  Top Layer w0.381: R15.1 101.67,64.5 Q2.3
$1N1490: length 2.9
  Top Layer w0.381: Q3.3 101.67,59.42 R16.1
$1N3803: length 6.2
  Top Layer w0.381: R22.1 20.89,29.41 Q5.1
$1N3805: length 3.1
  Top Layer w0.381: R21.1 24.45,30.4 Q4.1
$2N1552: length 11
  Top Layer w0.381: CN2.11 CN2.13 CN2.15 107.69,46.98 FH1.2
$2N8179: length 5.3
  Top Layer w0.381: D2.1 15.98,33.26 FH5.2
$2N8183: length 5.9
  Top Layer w0.381: USB6.1 10.66,28.21 FH5.1
$2N8184: length 10
  Top Layer w0.381: FH4.1 108.88,5.68 USB11.1
$2N9449: length 12.8
  Bottom Layer w0.381: U9.2 48.01,14.22 CN5.1
$2N9639: length 6.4
  Top Layer w0.381: Q1.1 48.19,15.32 R12.1
$2N9646: length 17.2
  Top Layer w0.381: Q1.3 52.75,8.04 55.12,10.41 CN5.2
$2N17292: length 5.6
  Top Layer w0.381: D1.1 73.9,51.59 FH2.1
$2N17305: length 15.7
  Top Layer w0.381: U14.4 69.34,62.23 69.34,51.69 67.94,50.29 D1.2
$2N17355: length 11.9
  Top Layer w0.381: FH3.1 50.8,62.73 U15.4

## Copper pours and planes (outline as drawn; the poured copper is in the pictures)
GND on Bottom Layer: -2.79,-5.84 122.43,-5.84 122.43,77.47 48.51,77.47 44.2,73.15 44.2,64.01 44.21,64 -1.53,64 -2.79,62.74
VCC on Top Layer: -12.19,-0.25 130.3,-0.25 130.3,73.15 45.21,73.15 44.2,72.14 44.2,63.75 -12.19,63.75

## Text on the board
Bottom Silkscreen Layer: Access Control Core | RIT SHED Makerspace | Version 2.0.1 | May 24 | Designed By: Jim Heaney
Top Silkscreen Layer: UART | Key Switch | KO132C1501 | +3v | +5v | Buzzer | P1 | HID | See Reverse for Board Information | 2 | 3 | 4 | 1 | Switch 1 | Switch 2 | + | -
